# Altium project Bluepill.PrjPcb
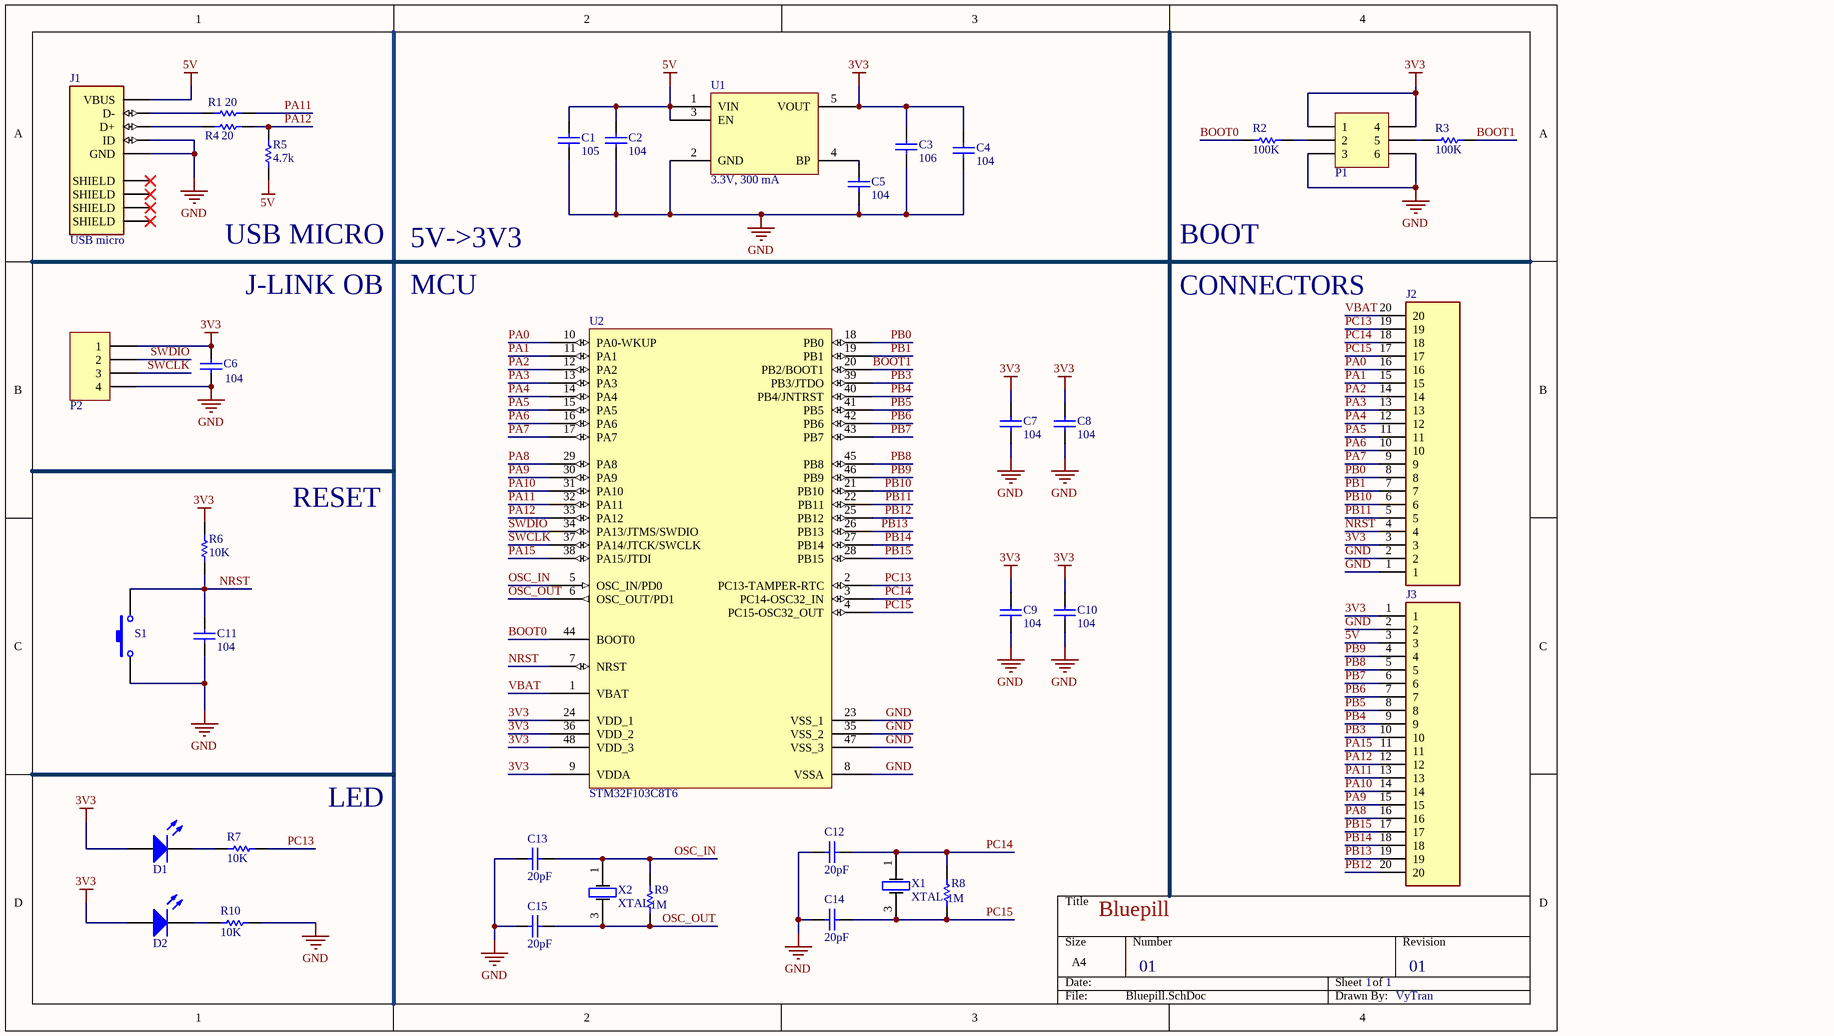
[diagram p0: Bluepill.SchDoc]
1 sheet, 37 parts. Net scope: global (net labels, ports and power ports of the same name join across sheets).
Board file: Bluepill.PcbDoc

## Sheet Bluepill.SchDoc: Bluepill
size A4; CompanyName: HCMUT; DrawnBy: VyTran; DocumentNumber: 01; Revision: 01; SheetNumber: 1; SheetTotal: 1; ImagePath: C:\Users\GMT\OneDrive\Pictures\42e9a759ef216b2872b584ae29dc734c

### Parts
C1  value 105  [C0805]  (hidden comment: Capacitor)
C2  value 104  [C0805]  (hidden comment: Capacitor)
C3  value 106  [C0805]  (hidden comment: Capacitor)
C4  value 104  [C0805]  (hidden comment: Capacitor)
C5  value 104  [C0805]  (hidden comment: Capacitor)
C6  value 104  [C0805]  (hidden comment: Capacitor)
C7  value 104  [C0805]  (hidden comment: Capacitor)
C8  value 104  [C0805]  (hidden comment: Capacitor)
C9  value 104  [C0805]  (hidden comment: Capacitor)
C10  value 104  [C0805]  (hidden comment: Capacitor)
C11  value 104  [C0805]  (hidden comment: Capacitor)
C12  value 20pF  [C0805]  (hidden comment: Capacitor)
C13  value 20pF  [C0805]  (hidden comment: Capacitor)
C14  value 20pF  [C0805]  (hidden comment: Capacitor)
C15  value 20pF  [C0805]  (hidden comment: Capacitor)
D1  LED SMD  [LED_0603_Blue]  (value not drawn)
D2  LED SMD  [LED_0603_Blue]  (value not drawn)
J1  USB micro  [GCT_USB3090-XX-X_REVE]
J2  2-87220-0  [TE_2-87220-0]  (value not drawn)
J3  2-87220-0  [TE_2-87220-0]  (value not drawn)
P1  Header 3X2  [JP3x2]  (value not drawn)
P2  Header 4  [JP4]  (value not drawn)
R1  value 20  [R0805]  (hidden comment: Resistor)
R2  value 100K  [R0805]  (hidden comment: Resistor)
R3  value 100K  [R0805]  (hidden comment: Resistor)
R4  value 20  [R0805]  (hidden comment: Resistor)
R5  value 4.7k  [R0805]  (hidden comment: Resistor)
R6  value 10K  [R0805]  (hidden comment: Resistor)
R7  value 10K  [R0805]  (hidden comment: Resistor)
R8  value 1M  [R0805]  (hidden comment: Resistor)
R9  value 1M  [R0805]  (hidden comment: Resistor)
R10  value 10K  [R0805]  (hidden comment: Resistor)
S1  Tact SW - 2Pin  [SW-SMD]  (value not drawn)
U1  3.3V, 300 mA  [RT9193-xxGB]
U2  STM32F103C8T6  [TSQFP50P900X900X160-48N]
X1  XTAL  [XTAL 3225]
X2  XTAL  [XTAL 3225]

### Nets
3V3: C3.2 C4.2 C6.2 C7.2 C8.2 C9.2 C10.2 D1.1(A) D2.1(A) J2.3 J3.1 P1.1 P1.4 P2.1 R6.2 U1.5(VOUT) U2.9(VDDA) U2.24(VDD_1) U2.36(VDD_2) U2.48(VDD_3)
5V: C1.2 C2.2 J1.1(VBUS) J3.3 R5.1 U1.1(VIN) U1.3(EN)
GND: C1.1 C2.1 C3.1 C4.1 C5.1 C6.1 C7.1 C8.1 C9.1 C10.1 C11.1 C12.2 C13.2 C14.2 C15.2 J1.4(ID) J1.5(GND) J2.1 J2.2 J3.2 P1.3 P1.6 P2.4 R10.1 S1.1 U1.2(GND) U2.8(VSSA) U2.23(VSS_1) U2.35(VSS_2) U2.47(VSS_3)
BOOT0: R2.2 U2.44(BOOT0)
BOOT1: R3.1 U2.20(PB2/BOOT1)
NRST: C11.2 J2.4 R6.1 S1.2 U2.7(NRST)
OSC_IN: C13.1 R9.2 U2.5(OSC_IN/PD0) X2.1
OSC_OUT: C15.1 R9.1 U2.6(OSC_OUT/PD1) X2.3
PA0: J2.16 U2.10(PA0-WKUP)
PA1: J2.15 U2.11(PA1)
PA2: J2.14 U2.12(PA2)
PA3: J2.13 U2.13(PA3)
PA4: J2.12 U2.14(PA4)
PA5: J2.11 U2.15(PA5)
PA6: J2.10 U2.16(PA6)
PA7: J2.9 U2.17(PA7)
PA8: J3.16 U2.29(PA8)
PA9: J3.15 U2.30(PA9)
PA10: J3.14 U2.31(PA10)
PA11: J3.13 R1.1 U2.32(PA11)
PA12: J3.12 R4.1 R5.2 U2.33(PA12)
PA15: J3.11 U2.38(PA15/JTDI)
PB0: J2.8 U2.18(PB0)
PB1: J2.7 U2.19(PB1)
PB3: J3.10 U2.39(PB3/JTDO)
PB4: J3.9 U2.40(PB4/JNTRST)
PB5: J3.8 U2.41(PB5)
PB6: J3.7 U2.42(PB6)
PB7: J3.6 U2.43(PB7)
PB8: J3.5 U2.45(PB8)
PB9: J3.4 U2.46(PB9)
PB10: J2.6 U2.21(PB10)
PB11: J2.5 U2.22(PB11)
PB12: J3.20 U2.25(PB12)
PB13: J3.19 U2.26(PB13)
PB14: J3.18 U2.27(PB14)
PB15: J3.17 U2.28(PB15)
PC13: J2.19 R7.1 U2.2(PC13-TAMPER-RTC)
PC14: C12.1 J2.18 R8.2 U2.3(PC14-OSC32_IN) X1.1
PC15: C14.1 J2.17 R8.1 U2.4(PC15-OSC32_OUT) X1.3
SWCLK: P2.3 U2.37(PA14/JTCK/SWCLK)
SWDIO: P2.2 U2.34(PA13/JTMS/SWDIO)
VBAT: J2.20 U2.1(VBAT)
NetC5_2: C5.2 U1.4(BP)
NetD1_2: D1.2(K) R7.2
NetD2_2: D2.2(K) R10.2
NetJ1_2: J1.2(D-) R1.2
NetJ1_3: J1.3(D+) R4.2
NetP1_2: P1.2 R2.1
NetP1_5: P1.5 R3.2

Not connected (* = marked no-connect by the designer): J1 6(SHIELD)* 7(SHIELD)* 8(SHIELD)* 9(SHIELD)*

### Notes on the sheet
- (near R5) USB MICRO
- 5V->3V3
- BOOT
- J-LINK OB
- MCU
- CONNECTORS
- RESET
- LED

### Library data of the parts
D1 D2 = LED SMD: LED
J1 = USB3090-XX-X_REVE: USB - micro AB USB 2.0 Receptacle Connector 5 Position Surface Mount, Right Angle; Through Hole, 2.35mm profile, 5 Pins, Horizontal, Bottom mount; MF: Global Connector Technology; MP: USB3090-30-A; SnapEDA_Link: https://www.snapeda.com/parts/USB3090-30-A/Global+Connector+Technology/view-part/?ref=snap; Package: None; Value: *; Check_prices: https://www.snapeda.com/parts/USB3090-30-A/Global+Connector+Technology/view-part/?ref=eda
J2 J3 = 2-87220-0: Conn Unshrouded Header HDR 20 POS 2.54mm Solder ST Thru-Hole Carton; MF: TE Connectivity; Number_of_Positions: 20; Product_Type: Connector; Centerline_Pitch: 2.54 mm[.1 in]; Price: None; MP: 2-87220-0; Package: None; Value: *; Availability: Warning; EU_RoHS_Compliance: Compliant; SnapEDA_Link: https://www.snapeda.com/parts/2-87220-0/TE%20Connectivity%20AMP%20Connectors/view-part/397035/?ref=snap; Purchase-URL: https://pricing.snapeda.com/search/part/2-87220-0/?ref=eda; Check_prices: https://www.snapeda.com/parts/2-87220-0/TE%20Connectivity%20AMP%20Connectors/view-part/397035/?ref=eda
P1 = Header 3X2: Header, 3-Pin, Dual row; LatestRevisionDate: 17-Jul-2002; LatestRevisionNote: Re-released for DXP Platform.; Publisher: Altium Limited
P2 = Header 4: Header, 4-Pin; LatestRevisionDate: 17-Jul-2002; LatestRevisionNote: Re-released for DXP Platform.; Publisher: Altium Limited
S1 = Tact SW - 2Pin: Switch button 2 pin
U1 = RT9193-33GB: LDO Voltage Regulators 300mA, Ultra-Low Noise, Ultra-Fast CMOS LDO Regulator, SOT-23-5,  3.3 V; Manufacturer: Richtek; Rated Current: 90 uA; Voltage Input Minimum: 2.5V; PSRR: - 70 dB; Voltage Drop: 220 mV; Voltage Input Maximum: 5.5V; Packaging: SOT-23-5; Voltage Output: 3.3V; Current Output: 300 mA; Operating Temperature: - 40 C to  + 85 C; Mounting Technology: SMD/SMT; Product: LDO Voltage Regulators; ComponentLink1Description: Datasheet link; ComponentLink1URL: https://www.mouser.vn/datasheet/2/1458/DS9193_18-3104722.pdf; ComponentLink2Description: Supplier 1 URL; ComponentLink2URL: https://www.mouser.vn/ProductDetail/Richtek/RT9193-33GB?qs=amGC7iS6iy8ybRcZ9Wn2ww%3D%3D; ComponentLink3Description: Supplier 2 URL; ComponentLink3URL: https://www.digikey.com/en/products/detail/richtek-usa-inc/RT9193-33GB/2470048?s=N4IgTCBcDaIEoBUCcBGJBmAtO9BxAQiALoC%2BQA; ComponentLink4Description: Supplier 3 URL; ComponentLink4URL: N/A; Supplier 1 Name: Mouser; Supplier 1 SN: 835-RT9193-33GB; Supplier 1 URL: https://www.mouser.vn/ProductDetail/Richtek/RT9193-33GB?qs=amGC7iS6iy8ybRcZ9Wn2ww%3D%3D; Supplier 2 Name: Digi-Key; Supplier 2 SN: 1028-1014-6-ND; Supplier 2 URL: https://www.digikey.com/en/products/detail/richtek-usa-inc/RT9193-33GB/2470048?s=N4IgTCBcDaIEoBUCcBGJBmAtO9BxAQiALoC%2BQA; Supplier 3 Name: thegioiic; Supplier 3 SN: N/A; Supplier 3 URL: N/A; Value: 3.3V, 300 mA
U2 = STM32F103C8T6: Manufacturer: ST; ComponentLink1Description: Supplier 1 Link
X1 X2 = XTAL: Value: 16MHz